# EAGLE design bilancia_smart (EAGLE 7.3.0)
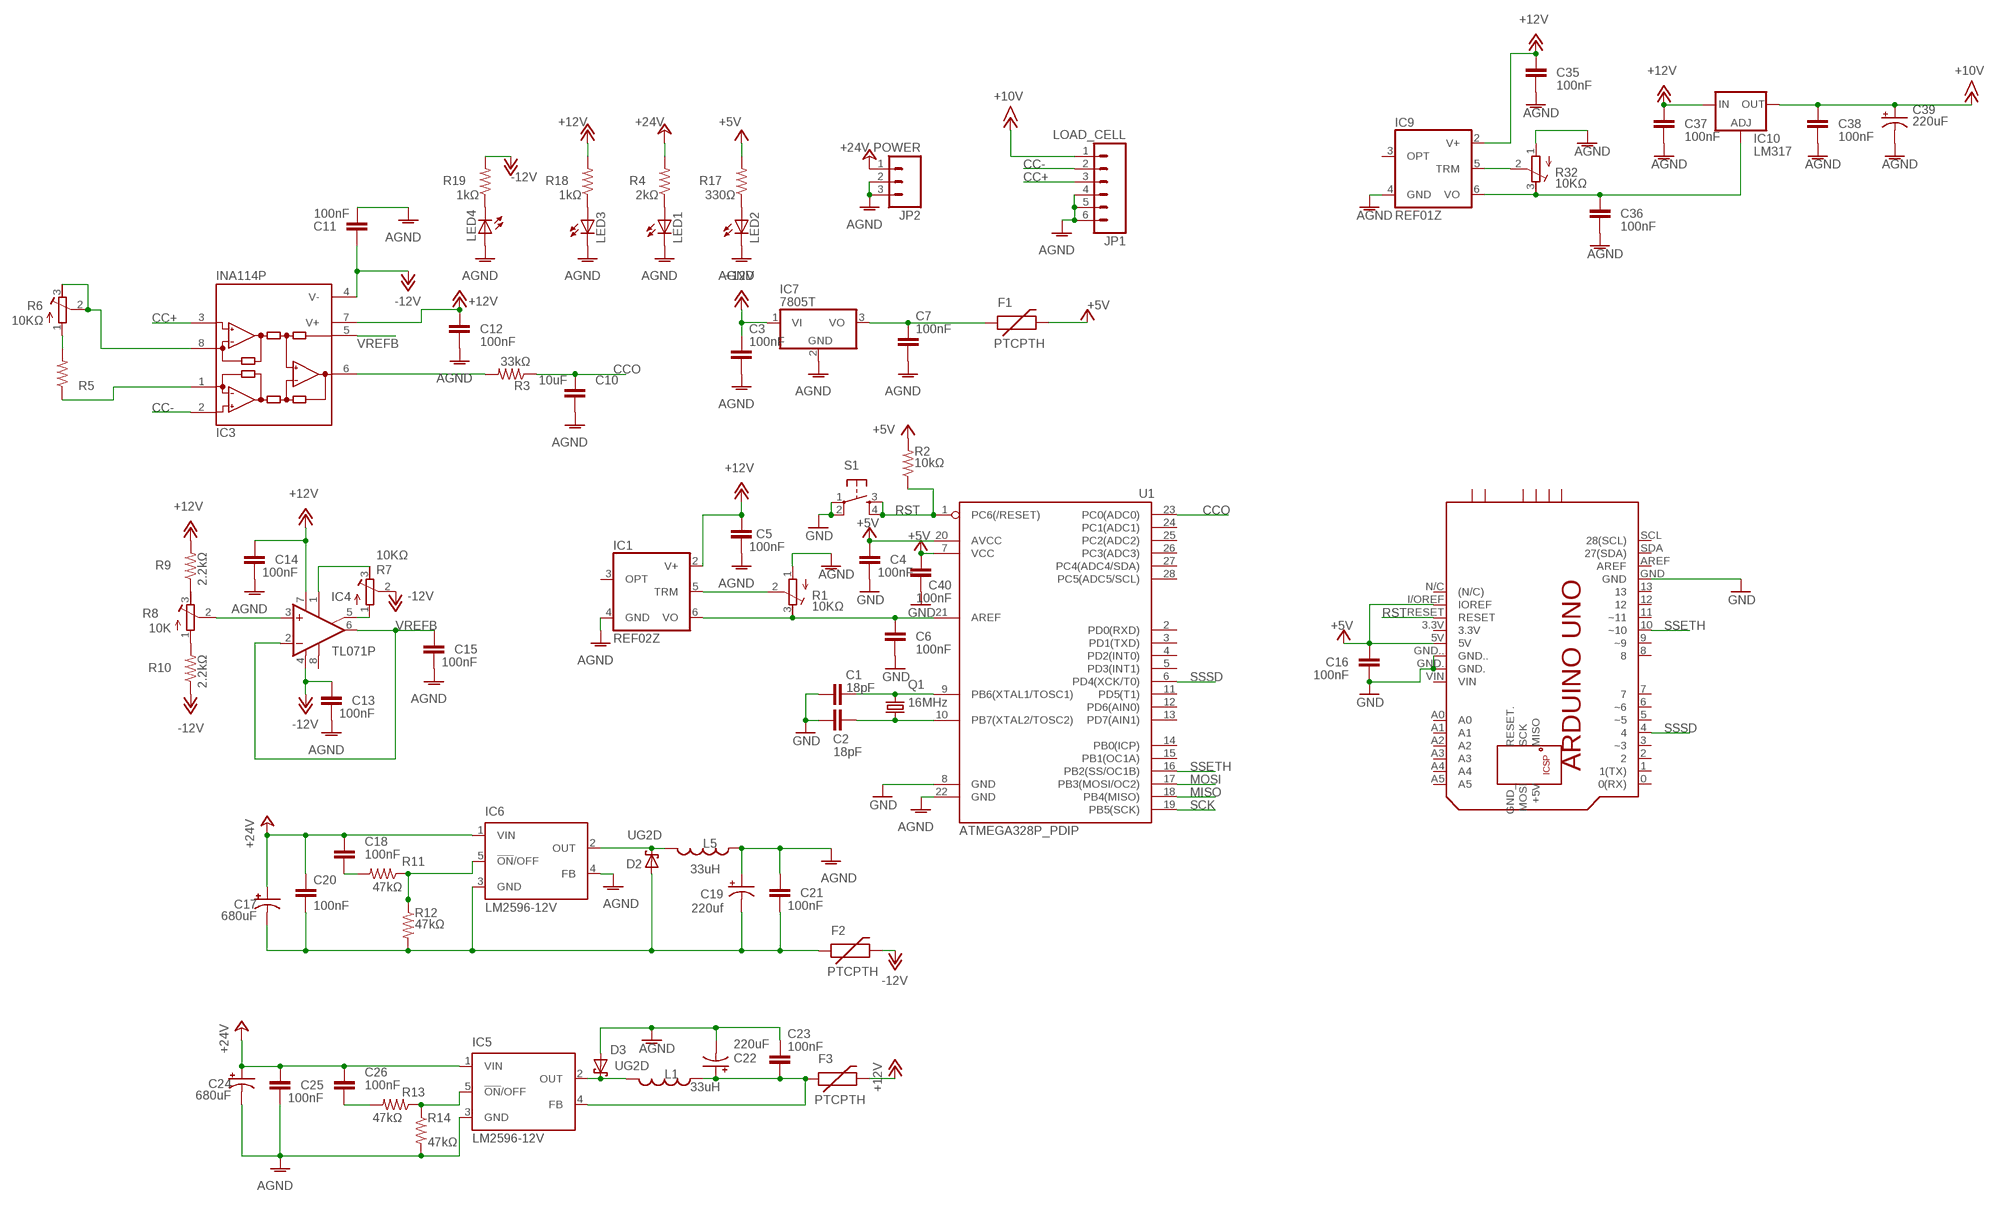
[diagram p0: schematic, sheet 1]

## Parts
C1  18pF  C2.5/2  [C2.5-2]
C2  18pF  C2.5/2  [C2.5-2]
C3  100nF  C2.5/2  [C2.5-2]
C4  100nF  C2.5/2  [C2.5-2]
C5  100nF  C2.5/2  [C2.5-2]
C6  100nF  C2.5/2  [C2.5-2]
C7  100nF  C2.5/2  [C2.5-2]
C10  10uF  C2.5/2  [C2.5-2]
C11  100nF  C2.5/2  [C2.5-2]
C12  100nF  C2.5/2  [C2.5-2]
C13  100nF  C2.5/2  [C2.5-2]
C14  100nF  C2.5/2  [C2.5-2]
C15  100nF  C2.5/2  [C2.5-2]
C16  100nF  C2.5/2  [C2.5-2]
C17  680uF  CPOL-USE5-8.5  [E5-8,5]
C18  100nF  C2.5/2  [C2.5-2]
C19  220uf  CPOL-USE5-8.5  [E5-8,5]
C20  100nF  C2.5/2  [C2.5-2]
C21  100nF  C2.5/2  [C2.5-2]
C22  220uF  CPOL-USE5-8.5  [E5-8,5]
C23  100nF  C2.5/2  [C2.5-2]
C24  680uF  CPOL-USE5-8.5  [E5-8,5]
C25  100nF  C2.5/2  [C2.5-2]
C26  100nF  C2.5/2  [C2.5-2]
C35  100nF  C2.5/2  [C2.5-2]
C36  100nF  C2.5/2  [C2.5-2]
C37  100nF  C2.5/2  [C2.5-2]
C38  100nF  C2.5/2  [C2.5-2]
C39  220uF  CAP_POLPTH1  [CPOL-RADIAL-100UF-25V]
C40  100nF  C2.5/2  [C2.5-2]
D2  UG2D  SCHOTTKY-DIODEDO41-7  [DO41-7]
D3  UG2D  SCHOTTKY-DIODEDO41-7  [DO41-7]
F1  PTCPTH  [PTC]
F2  PTCPTH  [PTC]
F3  PTCPTH  [PTC]
IC1  REF02Z  [DIL08]
IC3  INA114P  [DIL08]
IC4  TL071P  [DIL08]
IC5  LM2596-12V  LM2596T  [T05D]
IC6  LM2596-12V  LM2596T  [T05D]
IC7  7805T  [TO220H]
IC9  REF01Z  [DIL08]
IC10  LM317  LM317TS  [317TS]
JP1  LOAD_CELL  M06SIP  [1X06]
JP2  POWER  M03PTH  [1X03]
L1  33uH  INDUCTORRLB0912  [RLB0912]
L5  33uH  INDUCTORRLB0912  [RLB0912]
LED1  MINIMIDI_LED5MM  [MINIMIDI_LED5MM]
LED2  MINIMIDI_LED5MM  [MINIMIDI_LED5MM]
LED3  MINIMIDI_LED5MM  [MINIMIDI_LED5MM]
LED4  MINIMIDI_LED5MM  [MINIMIDI_LED5MM]
PCB1  ARDUINO_UNO  [ARDUINO_UNO]
Q1  16MHz  CRYSTALHC49S  [HC49/S]
R1  10KΩ  R-TRIMM64W  [RTRIM64W]
R2  10kΩ  R-US_0207/10  [0207/10]
R3  33kΩ  R-US_0207/10  [0207/10]
R4  2kΩ  R-US_0207/10  [0207/10]
R5  R-US_0207/10  [0207/10]
R6  10KΩ  R-TRIMM64W  [RTRIM64W]
R7  10KΩ  R-TRIMM64W  [RTRIM64W]
R8  10K  R-TRIMM64W  [RTRIM64W]
R9  2.2kΩ  R-US_0207/10  [0207/10]
R10  2.2kΩ  R-US_0207/10  [0207/10]
R11  47kΩ  R-US_0207/2V  [0207/2V]
R12  47kΩ  R-US_0207/2V  [0207/2V]
R13  47kΩ  R-US_0207/2V  [0207/2V]
R14  47kΩ  R-US_0207/2V  [0207/2V]
R17  330Ω  R-US_0207/10  [0207/10]
R18  1kΩ  R-US_0207/10  [0207/10]
R19  1kΩ  R-US_0207/10  [0207/10]
R32  10KΩ  R-TRIMM64W  [RTRIM64W]
S1  TAC_SWITCHPTH  [TACTILE-PTH]
U1  ATMEGA328P_PDIP  [DIL28-3]

## Nets
+5V [massa]: C4.2 C16.2 C40.2 F1.P$2 PCB1.5V PCB1.I/OREF(IOREF) R2.2 R17.2 U1.7(VCC) U1.20(AVCC)
+12V [massa]: C3.2 C5.1 C12.2 C14.2 C35.2 C37.2 F3.P$2 IC1.2(V+) IC3.7(V+) IC4.7(V+) IC7.1(VI) IC9.2(V+) IC10.3(IN) R9.2 R18.2
+15V: C38.2 C39.1(+) IC10.2(OUT) JP1.1 ; supply symbol labelled +10V
+24V [massa]: C17.+ C18.1 C20.1 C24.+ C25.1 C26.1 IC5.1(VIN) IC6.1(VIN) JP2.1 R4.2
-12V [massa]: C11.2 C13.2 F2.P$2 IC3.4(V-) IC4.4(V-) R7.2(S) R10.1 R19.2
AGND [massa]: C3.1 C5.2 C7.1 C10.1 C11.1 C12.1 C13.1 C14.1 C15.1 C19.+ C21.1 C22.- C23.2 C24.- C25.2 C35.1 C36.1 C37.1 C38.1 C39.2(-) D3.A IC1.4(GND) IC5.3(GND) IC6.4(FB) IC7.2(GND) IC9.4(GND) JP1.4 JP1.5 JP1.6 JP2.2 JP2.3 L5.1 LED1.K(C) LED2.K(C) LED3.K(C) LED4.A R1.1(E) R14.2 R32.1(E) U1.22(GND)
CC+: IC3.3(+IN) JP1.3
CC-: IC3.2(-IN) JP1.2
CCO: C10.2 R3.1 U1.23(PC0(ADC0))
GND [massa]: C1.1 C2.1 C4.1 C6.1 C16.1 C40.1 PCB1.GND PCB1.GND. PCB1.GND.. S1.1 S1.2 U1.8(GND)
MISO: U1.18(PB4(MISO))
MOSI: U1.17(PB3(MOSI/OC2))
N$1: C6.2 IC1.6(VO) R1.3(A) U1.21(AREF)
N$2: C2.2 Q1.2 U1.10(PB7(XTAL2/TOSC2))
N$3: C1.2 Q1.1 U1.9(PB6(XTAL1/TOSC1))
N$4: LED2.A R17.1
N$5: IC1.5(TRM) R1.2(S)
N$6 [massa]: C7.2 F1.P$1 IC7.3(VO)
N$7: IC3.6(OUT) R3.2
N$8: LED1.A R4.1
N$9: R5.2 R6.1(E)
N$10: IC3.8(RG) R6.2(S) R6.3(A)
N$11: IC3.1(RG) R5.1
N$12: IC4.5(ON2) R7.1(E)
N$13: IC4.1(ON1) R7.3(A)
N$14: IC6.5(!ON!/OFF) R11.1 R12.1
N$15: R8.3(A) R9.1
N$16: R8.1(E) R10.2
N$17: IC4.3(+IN) R8.2(S)
N$18: C18.2 R11.2
N$20 [massa]: D2.C IC6.2(OUT) L5.2
N$21 [massa]: C22.+ C23.1 F3.P$1 IC5.4(FB) L1.1
N$22 [massa]: C17.- C19.- C20.2 C21.2 D2.A F2.P$1 IC6.3(GND) R12.2
N$23 [massa]: D3.C IC5.2(OUT) L1.2
N$24: IC5.5(!ON!/OFF) R13.1 R14.1
N$25: C26.2 R13.2
N$28: LED3.A R18.1
N$29: LED4.K(C) R19.1
N$42: C36.2 IC9.6(VO) IC10.1(ADJ) R32.3(A)
N$43: IC9.5(TRM) R32.2(S)
RST: PCB1.RESET R2.1 S1.3 S1.4 U1.1(PC6(/RESET))
SCK: U1.19(PB5(SCK))
SSETH: PCB1.10(~10) U1.16(PB2(SS/OC1B))
SSSD: PCB1.4 U1.6(PD4(XCK/T0))
VREFB: C15.2 IC3.5(REF) IC4.2(-IN) IC4.6(OUT)
Unconnected: IC1.3(OPT) IC4.8(OPT) IC9.3(OPT) PCB1.0(0(RX)) PCB1.1(1(TX)) PCB1.2 PCB1.3(~3) PCB1.3.3V PCB1.5(~5) PCB1.6(~6) PCB1.7 PCB1.8 PCB1.9(~9) PCB1.11(~11) PCB1.12 PCB1.13 PCB1.+5V PCB1.<PWR>+V PCB1.<PWR>-V PCB1.<USB>+V PCB1.<USB>D+ PCB1.<USB>D- PCB1.<USB>GND PCB1.A0 PCB1.A1 PCB1.A2 PCB1.A3 PCB1.A4 PCB1.A5 PCB1.AREF PCB1.GND_ PCB1.MISO PCB1.MOSI PCB1.N/C((N/C)) PCB1.RESET. PCB1.SCK PCB1.SCL(28(SCL)) PCB1.SDA(27(SDA)) PCB1.VIN U1.2(PD0(RXD)) U1.3(PD1(TXD)) U1.4(PD2(INT0)) U1.5(PD3(INT1)) U1.11(PD5(T1)) U1.12(PD6(AIN0)) U1.13(PD7(AIN1)) U1.14(PB0(ICP)) U1.15(PB1(OC1A)) U1.24(PC1(ADC1)) U1.25(PC2(ADC2)) U1.26(PC3(ADC3)) U1.27(PC4(ADC4/SDA)) U1.28(PC5(ADC5/SCL))

## Library data of the parts
C1-C7 C10-C16 C18 C20 C21 C23 C25 C26 C35-C38 C40 = capacitor-wima:C: CAPACITOR naming: grid - package width
C17 C19 C22 C24 = resistor:CPOL-US: POLARIZED CAPACITOR, American symbol
C39 = SparkFun-Capacitors:CAP_POL: Capacitor Polarized These are standard SMD and PTH capacitors. Normally 10uF, 47uF, and 100uF in electrolytic and tantalum varieties. Always verify the external diameter of the through hole cap, it varies with capacity, voltage, and manufacturer. The EIA devices should be standard.
D2 D3 = adafruit:SCHOTTKY-DIODE: Schottky Diode
F1-F3 = SparkFun-PowerIC:PTC: Resettable Fuse PTC Resettable Fuse. Spark Fun Electronics SKU : COM-08357
IC1 = linear:REF02: VOLTAGE REFERENCE
IC3 = burr-brown:INA114: Precision Instrumentation Amplifier; MF: TEXAS INSTRUMENTS; MPN: INA114BP; OC_FARNELL: 1212399; OC_NEWARK: 74K3810
IC4 = linear:TL071: OP AMP
IC5 IC6 = national-semiconductor:LM2596: SIMPLE SWITCHER® Power Converter 150 kHz 3A Step-Down Voltage Regulator Source: http://www.national.com/ds/LM/LM2596.pdf; MPN: LM2596T-ADJ/LF02; OC_FARNELL: 9494162; OC_NEWARK: 65K5910
IC7 = linear:78*: Positive VOLTAGE REGULATOR Source: http://cache.national.com/ds/LM/LM78L05.pdf http://www.fairchildsemi.com/ds/LM/LM7805.pdf
IC9 = linear:REF01: VOLTAGE REFERENCE
IC10 = v-reg:LM317TS: VOLTAGE REGULATOR
JP1 = SparkFun-Connectors:M06: Header 6 Standard 6-pin 0.1" header. Use with straight break away headers (SKU : PRT-00116), right angle break away headers (PRT-00553), swiss pins (PRT-00743), machine pins (PRT-00117), and female headers (PRT-00115). Molex polarized connector foot print use with SKU : PRT-08094 with associated crimp pins and housings. NOTES ON THE VARIANTS LOCK and LOCK_LONGPADS... This footprint was designed to help hold the alignment of a through-hole component (i.e. 6-pin header) while soldering it into place. You may notice that each hole has been shifted either up or down by 0.005 of an inch from it's more standard position (which is a perfectly straight line). This slight alteration caused the pins (the squares in the middle) to touch the edges of the holes. Because they are alternating, it causes a "brace" to hold the component in place. 0.005 has proven to be the perfect amount of "off-center" position when using our standard breakaway headers. Although looks a little odd when you look at the bare footprint, once you have a header in there, the alteration is very hard to notice. Also,if you push a header all the way into place, it is covered up entirely on the bottom side. This idea of altering the position of holes to aid alignment will be further integrated into the Sparkfun Library for other footprints. It can help hold any component with 3 or more connection pins.
JP2 = SparkFun-Connectors:M03: Header 3 Standard 3-pin 0.1" header. Use with straight break away headers (SKU : PRT-00116), right angle break away headers (PRT-00553), swiss pins (PRT-00743), machine pins (PRT-00117), and female headers (PRT-00115). Molex polarized connector foot print use with SKU : PRT-08232 with associated crimp pins and housings.
L1 L5 = SparkFun-Passives:INDUCTOR: Inductors Basic Inductor/Choke - 0603 and 1206. Footprints are not proven and vary greatly between part numbers. SRN6045- 33uH, 20% 1.4A
LED1-LED4 = AF_mshield-v1 (1):MINIMIDI_LED: LED OSRAM: - CHIPLED LG R971, LG N971, LY N971, LG Q971, LY Q971, LO R971, LY R971 LH N974, LH R974 LS Q976, LO Q976, LY Q976 LO Q996 - Hyper CHIPLED LW Q18S LB Q993, LB Q99A, LB R99A - SideLED LS A670, LO A670, LY A670, LG A670, LP A670 LB A673, LV A673, LT A673, LW A673 LH A674 LY A675 LS A676, LA A676, LO A676, LY A676, LW A676 LS A679, LY A679, LG A679 - Hyper Micro SIDELED® LS Y876, LA Y876, LO Y876, LY Y876 LT Y87S - SmartLED LW L88C, LW L88S LB L89C, LB L89S, LG L890 LS L89K, LO L89K, LY L89K LS L896, LA L896, LO L896, LY L896 - TOPLED LS T670, LO T670, LY T670, LG T670, LP T670 LSG T670, LSP T670, LSY T670, LOP T670, LYG T670 LG T671, LOG T671, LSG T671 LB T673, LV T673, LT T673, LW T673 LH T674 LS T676, LA T676, LO T676, LY T676, LB T676, LH T676, LSB T676, LW T676 LB T67C, LV T67C, LT T67C, LS T67K, LO T67K, LY T67K, LW E67C LS E67B, LA E67B, LO E67B, LY E67B, LB E67C, LV E67C, LT E67C LW T67C LS T679, LY T679, LG T679 LS T770, LO T770, LY T770, LG T770, LP T770 LB T773, LV T773, LT T773, LW T773 LH T774 LS E675, LA E675, LY E675, LS T675 LS T776, LA T776, LO T776, LY T776, LB T776 LHGB T686 LT T68C, LB T68C - Hyper Mini TOPLED® LB M676 - Mini TOPLED Santana® LG M470 LS M47K, LO M47K, LY M47K Source: http://www.osram.convergy.de/
PCB1 = E14_Arduino:ARDUINO_UNO: Device for representing an Arduino Uno board with a footprint in an EAGLE design. Created by Dave Young for Element14. More EAGLE documentation at: http://www.element14.com/community/community/knode/cadsoft_eagle
Q1 = adafruit:CRYSTAL: CRYSTAL; OC_FARNELL: 1667008; OC_NEWARK: unknown
R1 R6-R8 R32 = resistor:R-TRIMM: Trimm resistor
R2-R5 R9-R14 R17-R19 = resistor:R-US_: RESISTOR, American symbol
S1 = SparkFun-Electromechanical:TAC_SWITCH: Momentary Switch Button commonly used for reset or general input. Spark Fun Electronics SKU : COM-00097 SMT- SWCH-08247
U1 = SparkFun-DigitalIC:ATMEGA328P_PDIP: uC used in the Arduino 32kb flash, 1k EEPROM, 2k SRAM This is the through-hole version of this chip.

## Net classes
0 default: clearance 0.205 mm
1 massa: width 0.5 mm, clearance 0.205 mm

## Board
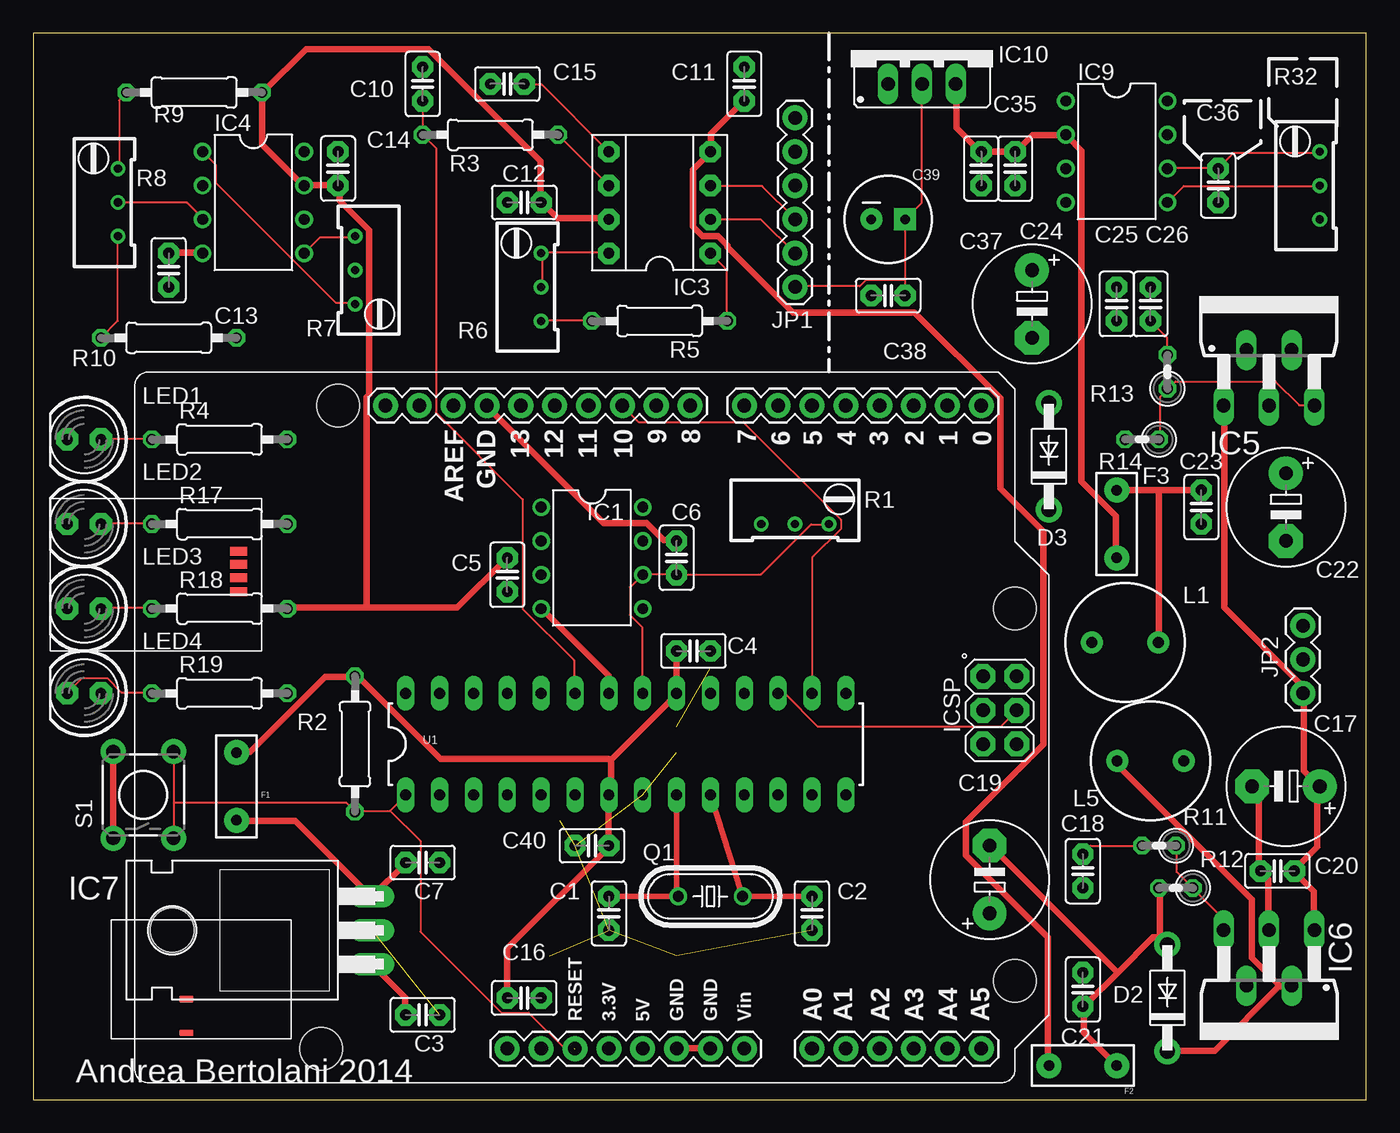
[diagram p1: board, top side]
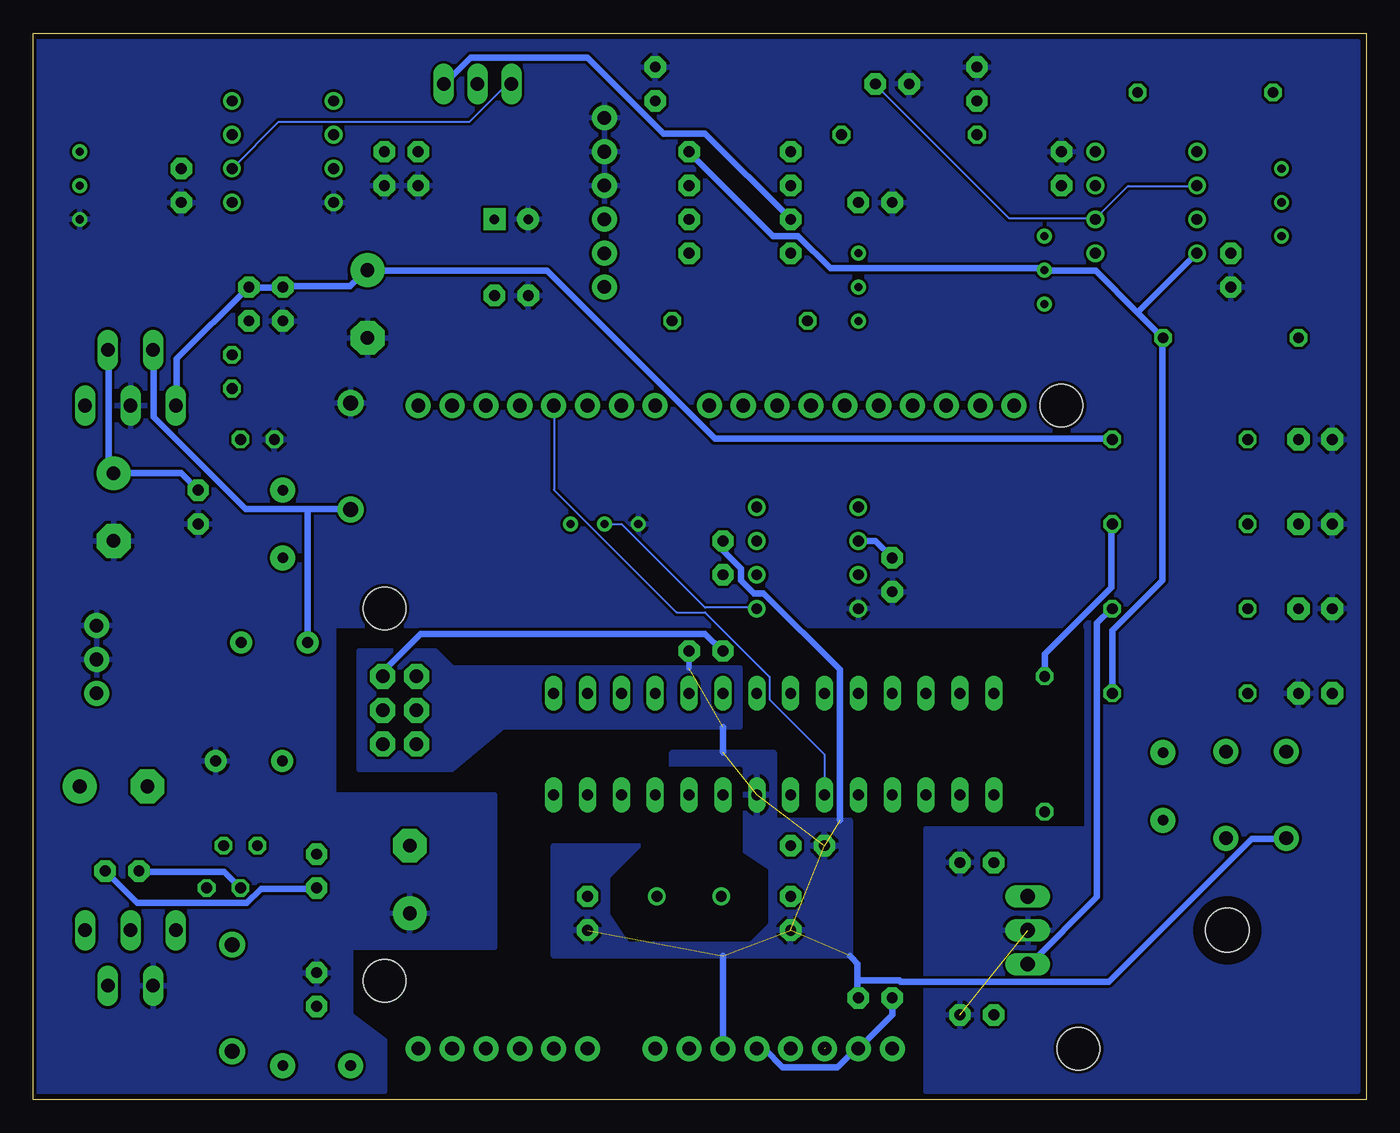
[diagram p2: board, bottom side, seen from below]

Size 100 x 80 mm. Coordinates in mm from the lower left corner, seen from the top.
Outline: 0,0 100,0 100,80 0,80 0,0
Copper layers (1*16): Top 0.035mm / dielectric 1.5mm / Bottom 0.035mm
Design rules "SeeedStudio_2layer_DRU_no_angle_20140221": minimum track width 6mil, minimum drill 12mil, track to track 6mil, track to pad 6mil, pad to pad 6mil, via to via 6mil, smd to smd 0mil, copper to edge 10mil, drill to drill 10mil, minimum pad ring 10mil, minimum via ring 6mil, stop-mask expansion 2mil, vias tented up to drill 100mil, thermal gap 10mil
tRestrict: area 45.1,12.1 to 56.5,24.8
bRestrict: area 45.1,12.1 to 56.5,24.8

### Footprints (pad centres in the part's own frame; a part is rotated, then mirrored left to right if it is on the bottom)
C2.5-2 = drill 0.813 pad 1.6 octagon: 1 -1.27,0; 2 1.27,0
E5-8,5 = drill 1.016 pad 2.54: + -2.54,0 | drill 1.016 pad 2.54 octagon: - 2.54,0
CPOL-RADIAL-100UF-25V = drill 0.7 pad 1.651 square: 1 1.27,0 | drill 0.7 pad 1.651: 2 -1.27,0
DO41-7 = drill 1.118 pad 1.93: A 4,0; C -4,0
PTC = drill 0.8 pad 1.88: P$1 -2.54,0; P$2 2.54,0
DIL08 = drill 0.813 pad 1.27: 1 -3.81,-3.81; 2 -1.27,-3.81; 3 1.27,-3.81; 4 3.81,-3.81; 5 3.81,3.81; 6 1.27,3.81; 7 -1.27,3.81; 8 -3.81,3.81
DIL08' = drill 0.813 pad 1.6 octagon: 1 -3.81,-3.81; 2 -1.27,-3.81; 3 1.27,-3.81; 4 3.81,-3.81; 5 3.81,3.81; 6 1.27,3.81; 7 -1.27,3.81; 8 -3.81,3.81
T05D = drill 1.016 long: 1 -3.404,-5.08; 2 -1.702,-0.914; 3 0,-5.08; 4 1.702,-0.914; 5 3.404,-5.08
TO220H = drill 1.118 long: 1 -2.54,-10.16; 2 0,-10.16; 3 2.54,-10.16 | hole 3.302: 0,4.826
317TS = drill 1.016 long: 1 -2.54,-2.54; 2 0,-2.54; 3 2.54,-2.54
1X06 = drill 1.016 pad 1.88: 1 0,0; 2 2.54,0; 3 5.08,0; 4 7.62,0; 5 10.16,0; 6 12.7,0
1X03 = drill 1.016 pad 1.88: 1 0,0; 2 2.54,0; 3 5.08,0
RLB0912 = drill 0.813 pad 1.651: 1 2.502,0; 2 -2.502,0
MINIMIDI_LED5MM = drill 0.813 pad 1.676 octagon: A -1.27,0; K 1.27,0
ARDUINO_UNO = drill 1.016 pad 1.88: 0 63.5,50.8; 1 60.96,50.8; 2 58.42,50.8; 3 55.88,50.8; 3.3V 35.56,2.54; 4 53.34,50.8; 5 50.8,50.8; 5V 38.1,2.54; 6 48.26,50.8; 7 45.72,50.8; 8 41.656,50.8; 9 39.116,50.8; 10 36.576,50.8; 11 34.036,50.8; 12 31.496,50.8; 13 28.956,50.8; A0 50.8,2.54; A1 53.34,2.54; A2 55.88,2.54; A3 58.42,2.54; A4 60.96,2.54; A5 63.5,2.54; AREF 23.876,50.8; GND 26.416,50.8; GND. 43.18,2.54; GND.. 40.64,2.54; I/OREF 30.48,2.54; N/C 27.94,2.54; RESET 33.02,2.54; SCL 18.796,50.8; SDA 21.336,50.8; VIN 45.72,2.54 | drill 1.016 pad 1.88 octagon: +5V 66.167,30.48; GND_ 66.167,25.4; MISO 63.627,30.48; MOSI 66.167,27.94; RESET. 63.627,25.4; SCK 63.627,27.94 | smd 1.016 x 0.508: <PWR>+V 3.861,6.274; <PWR>-V 3.861,3.734 | smd 1.27 x 0.635: <USB>+V 7.772,39.878; <USB>D+ 7.772,38.887; <USB>D- 7.772,37.871; <USB>GND 7.772,36.83 | hole 3.2: 66.04,7.62; 66.04,35.56; 15.24,50.8; 13.97,2.54
HC49/S = drill 0.813: 1 -2.413,0; 2 2.413,0
RTRIM64W = drill 0.61: 1 1.27,-2.54; 2 1.27,0; 3 1.27,2.54
0207/10 = drill 0.813 octagon: 1 -5.08,0; 2 5.08,0
0207/2V = drill 0.813 octagon: 1 -1.27,0; 2 1.27,0
TACTILE-PTH = drill 1.016 pad 1.88: 1 -3.251,2.261; 2 3.251,2.261; 3 -3.251,-2.261; 4 3.251,-2.261
DIL28-3 = drill 0.813 long: 1 -16.51,-3.81; 2 -13.97,-3.81; 3 -11.43,-3.81; 4 -8.89,-3.81; 5 -6.35,-3.81; 6 -3.81,-3.81; 7 -1.27,-3.81; 8 1.27,-3.81; 9 3.81,-3.81; 10 6.35,-3.81; 11 8.89,-3.81; 12 11.43,-3.81; 13 13.97,-3.81; 14 16.51,-3.81; 15 16.51,3.81; 16 13.97,3.81; 17 11.43,3.81; 18 8.89,3.81; 19 6.35,3.81; 20 3.81,3.81; 21 1.27,3.81; 22 -1.27,3.81; 23 -3.81,3.81; 24 -6.35,3.81; 25 -8.89,3.81; 26 -11.43,3.81; 27 -13.97,3.81; 28 -16.51,3.81

### Placement (x,y rotation side)
C1  43.18,13.97 90 top
C2  58.42,13.97 90 top
C3  29.21,6.35 180 top
C4  49.53,33.66 180 top
C5  35.56,39.37 270 top
C6  48.26,40.64 270 top
C7  29.21,17.78 180 top
C10  29.21,76.2 270 top
C11  53.34,76.2 270 top
C12  36.83,67.31 0 top
C13  10.16,62.23 90 top
C14  22.86,69.85 270 top
C15  35.56,76.2 0 top
C16  36.83,7.62 180 top
C17  93.98,23.5 180 top
C18  78.74,17.14 90 top
C19  71.75,16.51 90 top
C20  93.34,17.14 180 top
C21  78.74,8.26 270 top
C22  93.98,44.45 270 top
C23  87.63,44.45 270 top
C24  74.93,59.69 270 top
C25  81.28,59.69 270 top
C26  83.82,59.69 270 top
C35  73.66,69.85 90 top
C36  88.9,68.58 90 top
C37  71.12,69.85 90 top
C38  64.14,60.33 0 top
C39  64.14,66.04 0 top
C40  41.91,19.05 0 top
D2  85.09,7.62 90 top
D3  76.2,48.26 90 top
F1  15.24,23.5 90 top
F2  78.74,2.54 180 top
F3  81.28,43.18 270 top
IC1  41.91,40.64 270 top
IC3  INA114P  [DIL08']  46.99,67.31 90 top
IC4  16.51,67.31 270 top
IC5  92.71,57.15 0 top
IC6  92.71,7.62 180 top
IC7  15.24,12.7 90 top
IC9  81.28,71.12 270 top
IC10  66.67,78.74 0 top
JP1  57.15,60.96 90 top
JP2  95.25,30.48 90 top
L1  81.92,34.29 0 top
L5  83.82,25.4 0 top
LED1  3.81,49.53 180 top
LED2  3.81,43.18 180 top
LED3  3.81,36.83 180 top
LED4  3.81,30.48 180 top
PCB1  7.62,1.27 0 top
Q1  50.8,15.24 0 top
R1  57.15,44.45 270 top
R2  24.13,26.67 90 top
R3  34.29,72.39 0 top
R4  13.97,49.53 0 top
R5  46.99,58.42 180 top
R6  36.83,60.96 0 top
R7  25.4,62.23 180 top
R8  5.08,67.31 0 top
R9  12.06,75.56 0 top
R10  10.16,57.15 180 top
R11  84.45,19.05 180 top
R12  85.72,15.88 180 top
R13  85.09,54.61 90 top
R14  83.19,49.53 180 top
R17  13.97,43.18 0 top
R18  13.97,36.83 0 top
R19  13.97,30.48 0 top
R32  95.25,68.58 0 top
S1  8.26,22.86 90 top
U1  44.45,26.67 0 top

### Tracks (layer width: path | path; a pad name or v marks a point on that pad's centre or on a via)
+5V
  Top 0.5: F1.P$2 15.28,26.09 16.26,26.09 21.89,31.72 24.12,31.72 R2.2 24.3,31.54 24.57,31.54 30.56,25.55 43.16,25.55 43.34,25.46 | C4.2 48.25,33.6 48.25,30.56 U1.20 48.16,30.29 43.34,25.46 | 43.34,25.46 43.34,23.05 U1.7 43.16,22.78 43.16,19.12 C40.2 43.07,18.85 35.56,11.35 35.56,7.68 C16.2
  Bottom 0.5: R17.2 19.12,43.16 19.12,38.42 24.12,33.42 24.12,31.81 R2.2 | C16.2 35.56,7.59 35.56,6.34 38.06,3.84 PCB1.I/OREF 38.33,3.75 39.67,2.41 43.78,2.41 45.12,3.75 45.66,3.75 PCB1.5V | 73.71,31.81 73.71,32.17 70.94,34.94 49.59,34.94 48.34,33.69 C4.2
+12V
  Top 0.5: IC10.3 69.25,76.13 69.25,72.91 71.03,71.12 C37.2 71.3,71.12 73.45,71.12 C35.2 73.71,71.12 74.97,72.37 77.47,72.37 IC9.2 77.64,72.19 78.63,71.21 78.63,46.37 81.22,43.78 81.22,40.65 F3.P$2 | IC3.7 43.16,66.12 39.31,66.12 38.15,67.28 C12.2 38.06,67.55 38.06,70.41 29.66,78.81 20.46,78.81 17.33,75.68 R9.2 17.16,75.5 17.16,71.66 20.1,68.71 IC4.7 20.37,68.62 22.78,68.62 C14.2 22.96,68.35 22.96,67.46 25.2,65.22 25.2,52.9 25.02,52.72 25.02,36.9 | C3.2 27.88,6.43 27.88,7.68 25.46,10.1 IC7.1 | 25.02,36.9 31.81,36.9 35.47,40.56 C5.1 | 25.02,36.9 19.12,36.9 R18.2
  Bottom 0.5: IC1.2 38.06,41.91 36.81,41.91 35.56,40.65 C5.1 | IC7.1 25.38,10.19 25.2,10.19 20.19,15.19 20.19,35.74 19.12,36.81 R18.2 | IC10.3 69.16,76.22 67.19,78.18 58.44,78.18 52.72,72.46 49.59,72.46 43.24,66.12 IC3.7
+15V
  Top 0.152: IC10.2 66.66,76.13 66.66,67.28 65.49,66.12 C39.1 65.4,61.47 | 65.4,61.47 65.4,60.4 C38.2 | 65.4,61.47 62.46,61.47 62.01,61.03 57.18,61.03 JP1.1
+24V
  Top 0.5: IC6.1 96.05,12.78 96.05,15.64 94.62,17.07 C20.1 94.71,17.33 96.32,18.94 96.32,23.32 C17.+ 96.5,23.5 95.34,24.66 95.34,30.47 JP2.1 95.07,30.65 95.07,31.18 89.35,36.9 89.35,52 IC5.1
  Bottom 0.5: C18.1 78.81,15.81 82.92,15.81 83.99,14.74 92.21,14.74 94.53,17.07 C20.1 | IC5.1 89.26,52.09 89.26,55.58 83.9,60.94 C26.1 83.63,60.94 81.31,60.94 C25.1 81.04,61.03 76.22,61.03 75.14,62.1 C24.+ 74.88,62.19 61.47,62.19 48.87,49.59 19.12,49.59 R4.2
-12V
  Top 0.5: IC4.4 12.69,63.53 10.19,63.53 C13.2 | C11.2 53.25,74.88 50.84,72.46 50.84,71.12 IC3.4 50.66,70.94 49.5,69.78 49.5,65.49 50.22,64.78 51.38,64.78 52.09,64.06 52.09,63.98 57.01,59.06 66.12,59.06 72.55,52.63 72.55,45.84 75.77,42.62 75.77,26.63 69.96,20.82 69.96,18.32 76.13,12.15 76.13,2.59 F2.P$2
  Bottom 0.5: 17.16,59.06 15.28,57.18 R10.1 15.28,56.92 15.28,38.96 19.03,35.2 19.03,30.56 R19.2 | 17.16,59.06 20.28,62.19 24.12,62.19 R7.2 24.3,62.37 40.21,62.37 42.62,64.78 44.5,64.78 50.75,71.03 IC3.4 | 17.16,59.06 12.78,63.44 IC4.4
AGND  (1 unrouted)
  Top 0.5: U1.22 43.16,30.56 43.16,31.81 38.15,36.81 IC1.4
  pour Bottom: 0.64,0.64 0.64,79.38 99.69,79.38 99.69,0.64 73.66,0.64 73.66,4.45 76.2,6.35 76.2,11.43 65.41,11.43 65.41,22.86 77.47,22.86 77.47,35.56 20.95,35.56 20.95,20.32 33.02,20.32 33.02,0.64
CC+
  Top 0.152: IC3.3 50.84,68.53 54.68,68.53 57.09,66.12 JP1.3
CC-
  Top 0.152: IC3.2 50.84,66.03 54.59,66.03 57.09,63.53 JP1.2
CCO
  Top 0.152: C10.2 29.22,74.88 29.22,72.46 R3.1 29.22,72.37 30.2,71.39 30.2,51.55 36.72,45.03 36.72,36.81 40.56,32.97 40.56,30.56 U1.23
GND  (8 unrouted)
  Top 0.5: C6.1 48.25,41.99 47.27,41.99 46.02,43.24 42.8,43.24 34.04,52 PCB1.GND | S1.1 5.99,19.66 5.99,26.09 S1.2 | PCB1.GND.. 48.34,3.84 50.75,3.84 PCB1.GND.
  Bottom 0.406: C4.1 50.8,32.38
  Bottom 0.5: 38.15,8.94 38.15,10.19 38.6,10.63 38.73,10.79 | 38.15,8.94 38.15,7.68 C16.1 | 48.25,27.94 48.25,26.04 | 48.25,10.79 48.25,3.84 PCB1.GND.. | 38.15,8.94 35.02,8.94 34.94,8.85 19.3,8.85 8.58,19.57 6.08,19.57 S1.1 | 39.49,20.95 39.49,32.26 45.21,37.97 45.93,37.97 46.91,38.96 46.91,39.85 48.25,41.19 C6.1
  pour Bottom: 44.45,26.04 44.45,20.95 38.73,20.95 38.73,10.79 60.96,10.79 60.96,19.05 53.98,19.05 52.07,20.95 52.07,26.04
  pour Bottom: 75.56,33.66 75.56,24.77 68.58,24.77 64.77,27.94 46.99,27.94 46.99,32.38 68.58,32.38 69.85,33.66
MOSI
  Top 0.152: 73.71,29.13 72.55,27.97 58.88,27.97 56.38,30.47 55.93,30.47 U1.17
N$1
  Top 0.152: U1.21 45.66,30.56 45.66,35.47 44.76,36.37 44.76,38.42 45.66,39.31 IC1.6 45.75,39.4 48.25,39.4 C6.2 48.34,39.4 54.59,39.4 58.35,43.16 59.69,43.16 R1.3
N$2
  Top 0.406: U1.10 Q1.2 C2.2
N$3
  Top 0.406: C1.2 Q1.1 48.26,15.24 U1.9
N$4
  Top 0.152: R17.1 8.85,43.24 5.09,43.24 LED2.A
N$5
  Bottom 0.152: R1.2 57.09,43.16 55.84,43.16 49.59,36.9 45.75,36.9 IC1.5
N$6
  Top 0.5: C7.2 27.88,17.69 25.46,15.28 IC7.3 25.2,15.37 19.66,20.91 15.28,20.91 F1.P$1
N$7
  Top 0.152: R3.2 39.4,72.37 43.16,68.62 IC3.6
N$8
  Top 0.152: R4.1 8.85,49.59 5.09,49.59 LED1.A
N$9
  Top 0.152: R6.1 38.15,58.44 41.91,58.44 R5.2
N$10
  Top 0.152: R6.2 38.15,61.03 38.15,63.44 R6.3 38.15,63.53 43.16,63.53 IC3.8
N$11
  Top 0.152: R5.1 52,58.44 52,62.28 50.84,63.44 IC3.1
N$12
  Top 0.152: R7.1 24.12,64.69 21.53,64.69 20.37,63.53 IC4.5
N$13
  Top 0.152: R7.3 24.12,59.77 22.7,59.77 13.67,68.8 13.67,70.14 12.78,71.03 IC4.1
N$14
  Top 0.152: 87.03,15.9 R12.1 | R11.1 85.78,19.03 85.78,17.07 86.94,15.9 R12.1 | IC6.5 89.26,12.78 89.26,13.58 87.03,15.81 R12.1
N$15
  Top 0.152: R8.3 6.43,69.87 6.43,74.97 6.97,75.5 R9.1
N$16
  Top 0.152: R8.1 6.34,64.69 6.34,58.44 5.09,57.18 R10.2
N$17
  Top 0.152: R8.2 6.43,67.28 11.53,67.28 12.69,66.12 IC4.3
N$18
  Top 0.152: R11.2 83.19,19.03 79.34,19.03 78.81,18.5 C18.2
N$20
  Top 0.5: 93.46,8.49 94.35,8.49 IC6.2 | 93.46,8.49 88.64,3.66 85.15,3.66 D2.C | L5.2 81.4,25.38 81.4,25.02 91.41,15.01 91.41,10.63 93.37,8.67 93.46,8.49
N$21
  Top 0.5: 84.44,45.75 81.31,45.75 F3.P$1 | 84.44,45.75 87.56,45.75 C23.1 | 84.44,45.75 84.44,34.31 L1.1
  Bottom 0.5: IC5.4 94.35,56.2 94.35,47.35 94,47 C22.+ 93.73,47 88.9,47 87.65,45.75 C23.1
N$22
  Top 0.5: IC6.3 92.66,12.78 92.66,16.53 92.12,17.07 C20.2 91.94,17.33 91.94,22.96 91.49,23.41 C17.- | R12.2 84.53,15.81 84.53,12.24 85.06,11.71 D2.A 84.35,12.15 83.99,12.15 81.35,9.52 | F2.P$1 81.22,2.59 78.81,5 78.81,6.97 C21.2 78.98,7.15 81.35,9.52 | 81.35,9.52 71.84,19.03 C19.-
  Bottom 0.5: C20.2 92.03,17.07 85.69,17.07 84.53,15.9 R12.2
N$23
  Bottom 0.5: 79.43,44.32 76.22,44.32 D3.C | 79.43,44.32 84.08,44.32 90.96,51.2 90.96,56.2 IC5.2 | 79.43,44.32 79.43,34.31 L1.2
N$24
  Top 0.152: 84.44,49.59 R14.1 84.53,49.59 84.53,52.72 85.06,53.25 R13.1 85.15,53.34 85.69,53.88 93.19,53.88 94.98,52.09 96.05,52.09 IC5.5
N$25
  Top 0.152: R13.2 85.06,55.93 85.06,57.18 83.9,58.35 C26.2
N$28
  Top 0.152: R18.1 8.85,36.9 5.09,36.9 LED3.A
N$29
  Top 0.152: R19.1 8.85,30.56 6.61,30.56 5.54,31.63 3.66,31.63 2.59,30.56 LED4.K
N$42
  Top 0.152: R32.3 96.5,71.03 90.06,71.03 88.9,69.87 C36.2 88.81,69.87 85.15,69.87 IC9.6
  Bottom 0.152: IC10.1 64.15,76.13 64.51,76.13 67.28,73.36 81.58,73.36 85.06,69.87 IC9.6
N$43
  Top 0.152: R32.2 96.5,68.53 86.31,68.53 85.15,67.37 IC9.5
RST  (1 unrouted)
  Top 0.152: 10.54,22.25 10.54,26.09 S1.4 | 10.54,22.25 10.54,19.66 S1.3 | 26.76,21.67 27.88,22.78 U1.1 | 26.76,21.67 26.72,21.62 24.21,21.62 R2.1 24.12,21.62 23.5,22.25 10.54,22.25 | 40.56,3.84 39.85,3.84 37.17,6.52 35.12,6.52 29.04,12.6 29.04,19.39 26.76,21.67
SSETH
  Top 0.152: U1.16 58.44,30.56 58.44,40.65 60.58,42.8 60.58,43.51 53.25,50.84 45.39,50.84 44.23,52 PCB1.10
SSSD
  Bottom 0.152: U1.6 40.65,22.87 40.65,25.91 44.76,30.02 44.76,31.72 49.59,36.54 51.73,36.54 60.94,45.75 60.94,52 PCB1.4
VREFB
  Top 0.152: C15.2 36.9,76.13 38.15,76.13 43.16,71.12 IC3.5
  Bottom 0.152: IC4.2 12.78,68.53 17.87,68.53 20.28,66.12 IC4.6 20.37,66.12 26.8,66.12 36.81,76.13 C15.2

### Text on the board
tPlace: Andrea Bertolani 2014